# EAGLE design midi2cv.2.2.main (EAGLE 7.2.0)
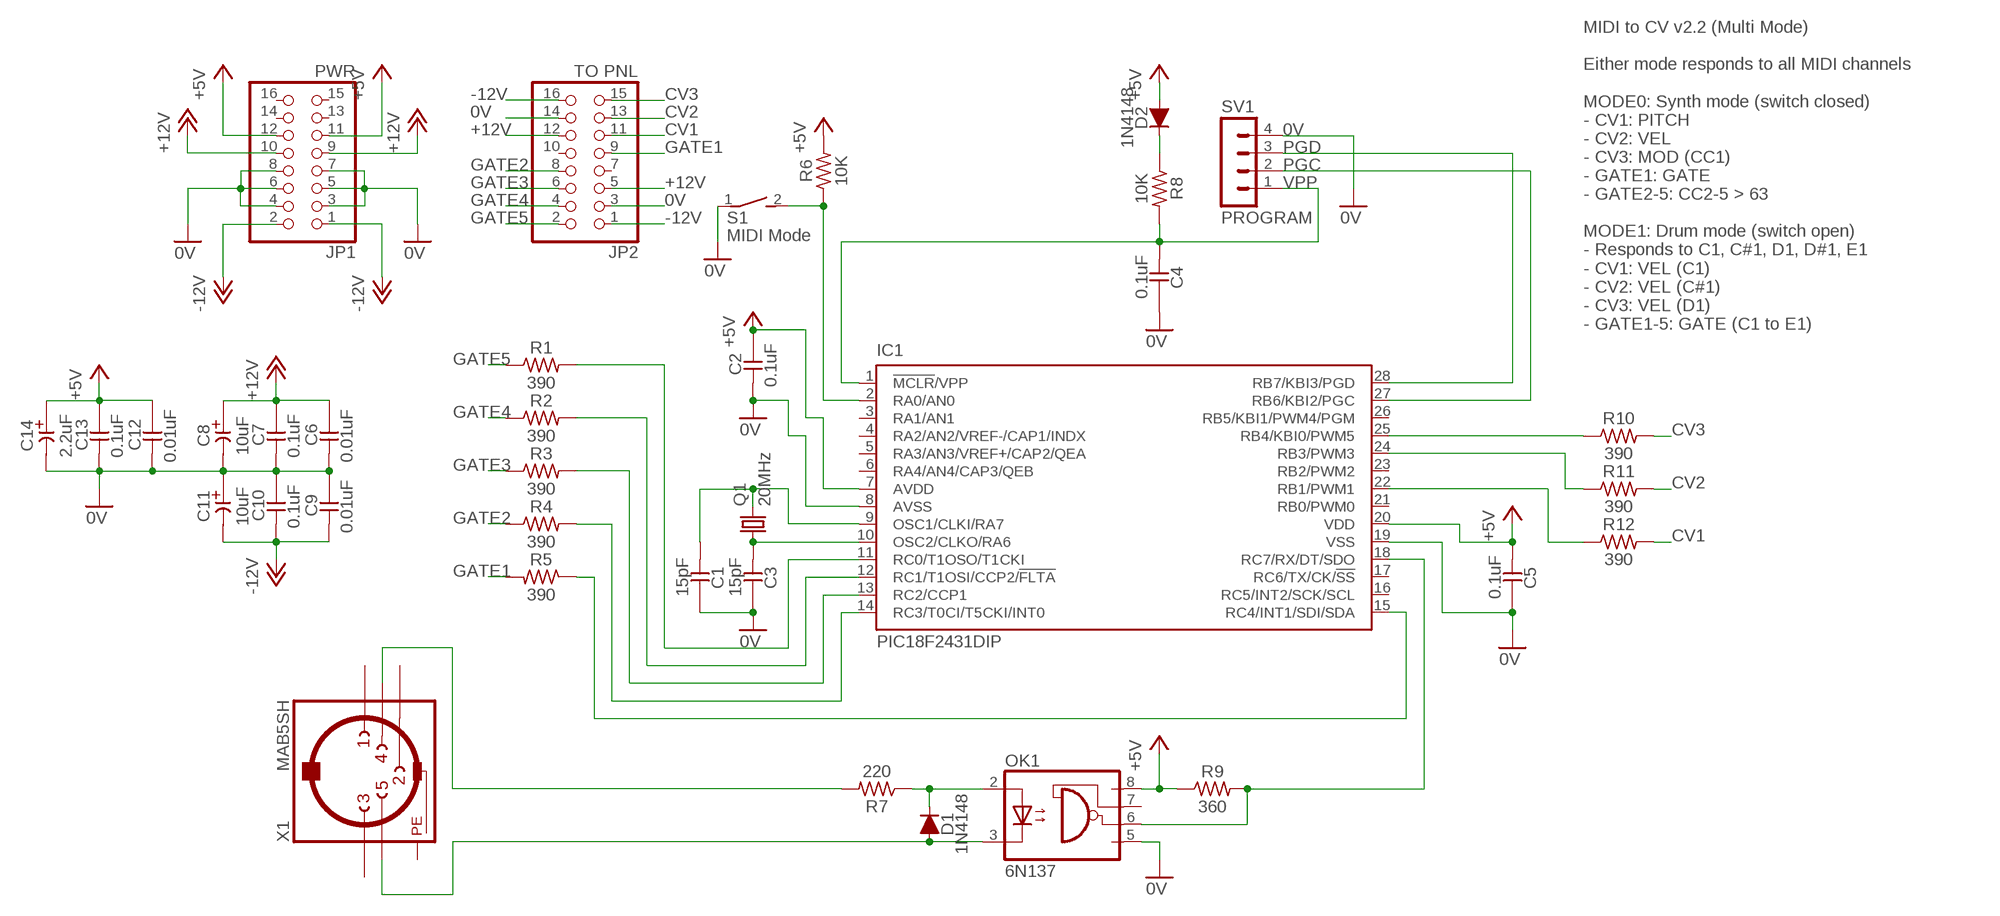
[diagram p0: schematic, sheet 1]

## Parts
C1  15pF  CC-US025-024X044  [C025-024X044]
C2  0.1uF  CC-US025-024X044  [C025-024X044]
C3  15pF  CC-US025-024X044  [C025-024X044]
C4  0.1uF  CC-US025-024X044  [C025-024X044]
C5  0.1uF  CC-US025-024X044  [C025-024X044]
C6  0.01uF  CC-US025-024X044  [C025-024X044]
C7  0.1uF  CC-US025-024X044  [C025-024X044]
C8  10uF  CE-USE2-5  [E2-5]
C9  0.01uF  CC-US025-024X044  [C025-024X044]
C10  0.1uF  CC-US025-024X044  [C025-024X044]
C11  10uF  CE-USE2-5  [E2-5]
C12  0.01uF  CC-US025-024X044  [C025-024X044]
C13  0.1uF  CC-US025-024X044  [C025-024X044]
C14  2.2uF  CE-USE2-5  [E2-5]
D1  1N4148  [DO35-7]
D2  1N4148  [DO35-7]
IC1  PIC18F2431DIP  [DIL28-3]
JP1  PWR  PINHD-2X8  [2X08]
JP2  TO PNL  PINHD-2X8  [2X08]
OK1  6N137  [DIL08]
Q1  20MHz  CRYSTALHC49S  [HC49/S]
R1  390  R0309/10  [0309/10]
R2  390  R0309/10  [0309/10]
R3  390  R0309/10  [0309/10]
R4  390  R0309/10  [0309/10]
R5  390  R0309/10  [0309/10]
R6  10K  R0309/10  [0309/10]
R7  220  R0309/10  [0309/10]
R8  10K  R0309/10  [0309/10]
R9  360  R0309/10  [0309/10]
R10  390  R0309/10  [0309/10]
R11  390  R0309/10  [0309/10]
R12  390  R0309/10  [0309/10]
S1  MIDI Mode  DS01E  [DS-01]
SV1  PROGRAM  MA04-1  [MA04-1]
X1  MAB5SH  [MAB5SH]

## Nets
0V: C1.1 C2.2 C3.1 C4.1 C5.1 C6.2 C7.2 C8.- C9.1 C10.1 C11.+ C12.2 C13.2 C14.- IC1.8(AVSS) IC1.19(VSS) JP1.3 JP1.4 JP1.5 JP1.6 JP1.7 JP1.8 JP2.3 JP2.14 OK1.5(GND) S1.1 SV1.4
+5V: C2.1 C5.2 C12.1 C13.1 C14.+ D2.A IC1.7(AVDD) IC1.20(VDD) JP1.11 JP1.12 OK1.8(VCC) R6.2 R9.1
+12V: C6.1 C7.1 C8.+ JP1.9 JP1.10 JP2.5 JP2.12
-12V: C9.2 C10.2 C11.- JP1.1 JP1.2 JP2.1 JP2.16
CV1: JP2.11 R12.2
CV2: JP2.13 R11.2
CV3: JP2.15 R10.2
GATE1: JP2.9 R5.2
GATE2: JP2.8 R4.1
GATE3: JP2.6 R3.1
GATE4: JP2.4 R2.1
GATE5: JP2.2 R1.1
N$1: D2.C R8.1
N$6: C3.2 IC1.10(OSC2/CLKO/RA6) Q1.1
N$9: R7.2 X1.4
N$10: D1.A OK1.3(C) X1.5
N$11: D1.C OK1.2(A) R7.1
N$13: IC1.18(RC7/RX/DT/SDO) OK1.6(VO) R9.2
N$16: IC1.25(RB4/KBI0/PWM5) R10.1
N$17: IC1.24(RB3/PWM3) R11.1
N$18: IC1.22(RB1/PWM1) R12.1
N$19: IC1.15(RC4/INT1/SDI/SDA) R5.1
N$20: IC1.2(RA0/AN0) R6.1 S1.2
N$26: IC1.11(RC0/T1OSO/T1CKI) R1.2
N$27: C1.2 IC1.9(OSC1/CLKI/RA7) Q1.2
N$28: IC1.12(RC1/T1OSI/CCP2/!FLTA) R2.2
N$29: IC1.13(RC2/CCP1) R3.2
N$30: IC1.14(RC3/T0CI/T5CKI/INT0) R4.2
PGC: IC1.27(RB6/KBI2/PGC) SV1.2
PGD: IC1.28(RB7/KBI3/PGD) SV1.3
VPP: C4.2 IC1.1(!MCLR!/VPP) R8.2 SV1.1
Unconnected: IC1.3(RA1/AN1) IC1.4(RA2/AN2/VREF-/CAP1/INDX) IC1.5(RA3/AN3/VREF+/CAP2/QEA) IC1.6(RA4/AN4/CAP3/QEB) IC1.16(RC5/INT2/SCK/SCL) IC1.17(RC6/TX/CK/!SS) IC1.21(RB0/PWM0) IC1.23(RB2/PWM2) IC1.26(RB5/KBI1/PWM4/PGM) JP1.13 JP1.14 JP1.15 JP1.16 JP2.7 JP2.10 OK1.7(VE) X1.1 X1.2 X1.3

## Notes on the sheet
- MIDI to CV v2.2 (Multi Mode)
  
  Either mode responds to all MIDI channels
  
  MODE0: Synth mode (switch closed)
  - CV1: PITCH
  - CV2: VEL
  - CV3: MOD (CC1)
  - GATE1: GATE
  - GATE2-5: CC2-5 > 63
  
  MODE1: Drum mode (switch open)
  - Responds to C1, C#1, D1, D#1, E1
  - CV1: VEL (C1)
  - CV2: VEL (C#1)
  - CV3: VEL (D1)
  - GATE1-5: GATE (C1 to E1)

## Power pins joined to a net without a drawn wire
PE: X1.PE X1.PE@(PE)

## Library data of the parts
C1-C7 C9 C10 C12 C13 = _common:CC-US: CAPACITOR, US symbol
C8 C11 C14 = _common:CE-US: ELECTROLYTIC CAPACITOR, US symbol
D1 D2 = _common:1N4148: DIODE high speed (Philips)
IC1 = _common:PIC18F2*31: USB Microcontrollers with nanoWatt Technology High-Performance, Enhanced Flash, 28-Pin, Source: http://ww1.microchip.com/downloads/en/devicedoc/39616d.pdf; MF: MICROCHIP; MPN: PIC18F2431-I/SP
JP1 JP2 = pinhead:PINHD-2X8: PIN HEADER
OK1 = optocoupler:6N137: MOTOROLA OPTO COUPLER; MPN: 6N137; OC_FARNELL: 1328376; OC_NEWARK: 52M1895
Q1 = crystal:CRYSTAL: CRYSTAL; OC_FARNELL: 1667008; OC_NEWARK: unknown
R1-R12 = _common:R: RESISTOR, US symbol
S1 = switch-dil:DS01E: DIL/CODE SWITCH; OC_FARNELL: unknown; OC_NEWARK: unknown
SV1 = con-lstb:MA04-1: PIN HEADER; OC_FARNELL: unknown; OC_NEWARK: unknown
X1 = con-hirschmann:MAB5SH: Female CONNECTOR 5 pins 90 deg. with shield, horizontal (DIN 41524); OC_FARNELL: 809883; OC_NEWARK: unknown

## Board
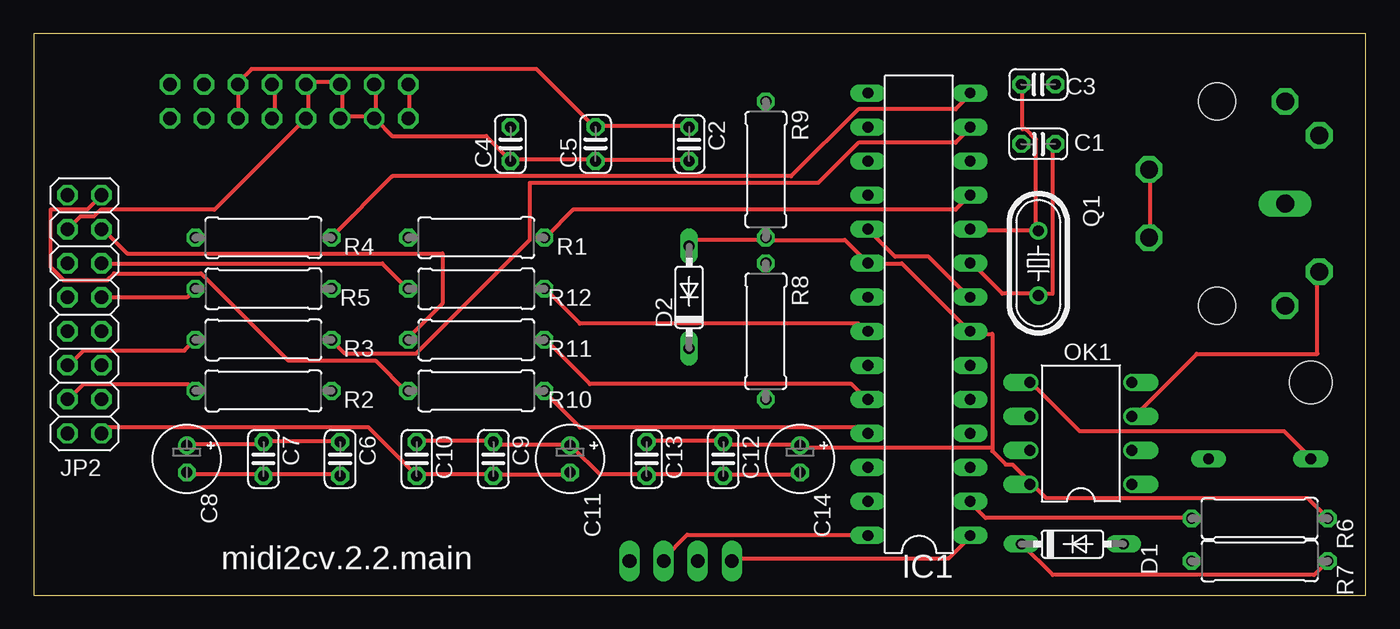
[diagram p1: board, top side]
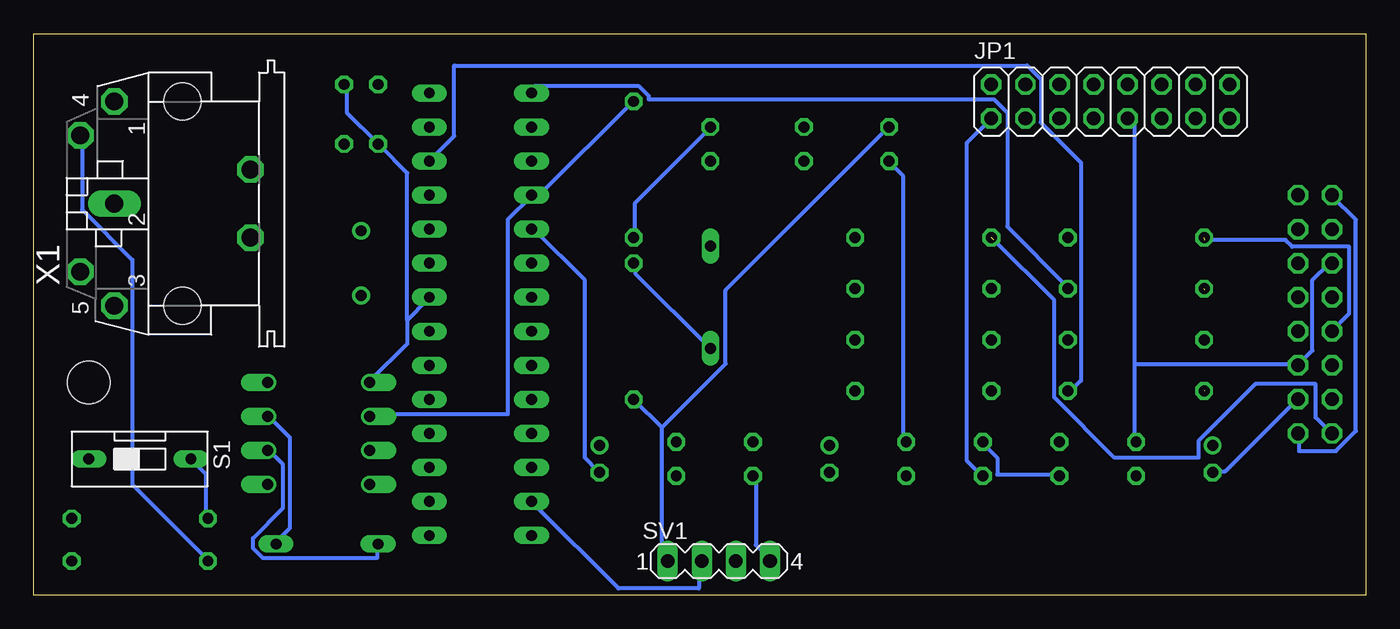
[diagram p2: board, bottom side, seen from below]

Size 99.36 x 41.9 mm. Coordinates in mm from the lower left corner, seen from the top.
Outline: 0,0 99.36,0 99.36,41.9 0,41.9 0,0
Copper layers (1*16): Top 0.035mm / dielectric 1.5mm / Bottom 0.035mm
Design rules "SeeedStudio_2layer_DRU_no_angle_20140221 *": minimum track width 12mil, minimum drill 12mil, track to track 6mil, track to pad 6mil, pad to pad 6mil, via to via 6mil, smd to smd 0mil, copper to edge 10mil, drill to drill 10mil, minimum pad ring 10mil, minimum via ring 6mil, stop-mask expansion 2mil, vias tented up to drill 100mil, thermal gap 10mil
Holes 3.2 mm at 95.25,15.88

### Footprints (pad centres in the part's own frame; a part is rotated, then mirrored left to right if it is on the bottom)
C025-024X044 = drill 0.813 octagon: 1 -1.27,0; 2 1.27,0
E2-5 = drill 0.813 pad 1.27: + -1.016,0 | drill 0.813 pad 1.27 octagon: - 1.016,0
DO35-7 = drill 0.813 long: A 3.81,0; C -3.81,0
DIL28-3 = drill 0.813 long: 1 -16.51,-3.81; 2 -13.97,-3.81; 3 -11.43,-3.81; 4 -8.89,-3.81; 5 -6.35,-3.81; 6 -3.81,-3.81; 7 -1.27,-3.81; 8 1.27,-3.81; 9 3.81,-3.81; 10 6.35,-3.81; 11 8.89,-3.81; 12 11.43,-3.81; 13 13.97,-3.81; 14 16.51,-3.81; 15 16.51,3.81; 16 13.97,3.81; 17 11.43,3.81; 18 8.89,3.81; 19 6.35,3.81; 20 3.81,3.81; 21 1.27,3.81; 22 -1.27,3.81; 23 -3.81,3.81; 24 -6.35,3.81; 25 -8.89,3.81; 26 -11.43,3.81; 27 -13.97,3.81; 28 -16.51,3.81
2X08 = drill 1.016 octagon: 1 -8.89,-1.27; 2 -8.89,1.27; 3 -6.35,-1.27; 4 -6.35,1.27; 5 -3.81,-1.27; 6 -3.81,1.27; 7 -1.27,-1.27; 8 -1.27,1.27; 9 1.27,-1.27; 10 1.27,1.27; 11 3.81,-1.27; 12 3.81,1.27; 13 6.35,-1.27; 14 6.35,1.27; 15 8.89,-1.27; 16 8.89,1.27
DIL08 = drill 0.813 offset: 1 -3.81,-3.81; 2 -1.27,-3.81; 3 1.27,-3.81; 4 3.81,-3.81; 5 3.81,3.81; 6 1.27,3.81; 7 -1.27,3.81; 8 -3.81,3.81
HC49/S = drill 0.813: 1 -2.413,0; 2 2.413,0
0309/10 = drill 0.813 octagon: 1 -5.08,0; 2 5.08,0
DS-01 = drill 0.813 long: 1 0,-3.81; 2 0,3.81
MA04-1 = drill 1.016 long: 1 -3.81,0; 2 -1.27,0; 3 1.27,0; 4 3.81,0
MAB5SH = drill 1.321 octagon: 1 7.62,5.08; 3 -7.62,5.08; 4 5.08,7.62; 5 -5.08,7.62; PE -2.54,-5.08; PE@ 2.54,-5.08 | drill 1.321 long: 2 0,5.08 | hole 2.794: 7.62,0; -7.62,0

### Placement (x,y rotation side)
C1  74.93,33.66 0 top
C2  48.9,33.66 270 top
C3  74.93,38.1 180 top
C4  35.56,33.66 90 top
C5  41.91,33.66 90 top
C6  22.86,10.16 270 top
C7  17.14,10.16 270 top
C8  11.43,10.16 270 top
C9  34.29,10.16 270 top
C10  28.57,10.16 270 top
C11  40.01,10.16 270 top
C12  51.44,10.16 270 top
C13  45.72,10.16 270 top
C14  57.15,10.16 270 top
D1  77.47,3.81 0 top
D2  48.9,22.23 90 top
IC1  66.04,20.95 90 top
JP1  19.05,36.83 0 bottom
JP2  3.81,20.95 90 top
OK1  78.11,12.06 90 top
Q1  74.93,24.77 270 top
R1  33.02,26.67 0 top
R2  17.14,15.24 0 top
R3  17.14,19.05 0 top
R4  17.14,26.67 0 top
R5  17.14,22.86 180 top
R6  91.44,5.71 0 top
R7  91.44,2.54 180 top
R8  54.61,19.68 270 top
R9  54.61,31.75 90 top
R10  33.02,15.24 180 top
R11  33.02,19.05 180 top
R12  33.02,22.86 180 top
S1  91.44,10.16 270 bottom
SV1  48.26,2.54 0 bottom
X1  88.27,29.21 90 bottom

### Tracks (layer width: path | path; a pad name or v marks a point on that pad's centre or on a via)
0V
  Top 0.305: S1.1 95.25,10.25 93.25,12.25 78,12.25 74.5,15.75 OK1.5 | IC1.19 62.25,27.25 64.25,25.25 66.75,25.25 69.75,22.25 IC1.8 | C2.2 48.75,32.5 42,32.5 C5.1 41.75,32.5 35.75,32.5 C4.1 35.5,32.5 33.75,34.25 26.75,34.25 25.5,35.5 JP1.3 | JP1.3 25.5,35.75 25.5,38 JP1.4 | 23,35.75 23,38 JP1.6 22.75,38.25 20.5,38.25 JP1.8 20.5,38 20.5,35.75 JP1.7 20.25,35.5 13.5,28.75 5,28.75 4.5,28.25 3.5,28.25 2.75,27.5 JP2.14 | 23,35.75 25.25,35.75 JP1.3 | 23,35.75 JP1.5 | C6.2 22.75,9 17.25,9 C7.2 17,9 11.5,9 C8.- | C10.1 28.75,11.5 34.25,11.5 C9.1 34.5,11.25 40,11.25 C11.+ 40.25,11 42.25,9 45.5,9 C13.2 45.75,9 51.25,9 C12.2 51.5,9 57,9 C14.-
  Bottom 0.305: C3.1 76,38 76,36 73.75,33.75 C1.1 73.5,33.5 71.5,31.5 71.5,20.5 | 71.5,20.5 71.5,18.75 74.25,16 OK1.5 | 71.5,20.5 70,22 IC1.8 | JP2.3 5.25,14.5 10.5,9.25 11.25,9.25 C8.- | SV1.4 44.5,2.75 45.5,3.75 45.5,8.75 C13.2 | C6.2 23,9 27.5,9 27.5,10.25 28.5,11.25 C10.1 | C4.1 35.5,32.25 34.5,31.25 34.5,11.5 C9.1 | IC1.19 62,27.25 58.25,23.5 58.25,10.25 57.25,9.25 C14.-
+5V
  Top 0.305: JP1.11 15.25,35.75 15.25,38 JP1.12 15.25,38.25 16.25,39.25 37.5,39.25 41.75,35 C5.2 42,35 48.75,35 C2.1 | C13.1 45.75,11.5 51.25,11.5 C12.1 51.5,11.25 57,11.25 C14.+ 57.25,11 71.5,11 | D2.A 49,26.25 49.25,26.5 54.5,26.5 R9.1 54.75,26.5 60.5,26.5 62,25 IC1.20 62.25,24.75 64.75,24.75 69.75,19.75 IC1.7 70,19.5 71.5,19.5 71.5,11 | 71.5,11 71.5,10.75 72.5,9.75 73,9.75 74.25,8.5 OK1.8 74.5,8.25 75.5,7.25 95,7.25 96.5,5.75 R6.2
  Bottom 0.305: C2.1 49,34.75 54.5,29.25 54.5,26.75 R9.1
+12V
  Top 0.305: JP1.9 18,35.75 18,38 JP1.10 | C8.+ 11.5,11.25 17,11.25 C7.1 17.25,11.5 22.75,11.5 C6.1
  Bottom 0.305: JP2.12 2.75,24.75 4,23.5 4,18.25 5,17.25 JP2.5 5.25,17.25 17.25,17.25 | 17.25,17.25 17.25,11.5 C7.1 | 17.25,17.25 17.25,35 17.75,35.5 JP1.9
-12V
  Top 0.305: JP1.1 28,35.75 28,38 JP1.2 | C11.- 40,9 34.5,9 C9.2 34.25,9 28.75,9 C10.2 28.5,9 25,12.5 5.5,12.5 5.25,12.25 JP2.1
  Bottom 0.305: JP2.16 2.5,29.75 0.75,28 0.75,12.25 2.25,10.75 5,10.75 5,12 JP2.1 | JP1.1 29.75,33.75 29.75,10 28.75,9 C10.2
CV1
  Top 0.305: R12.2 27.75,23 26,24.75 5.25,24.75 JP2.11
CV2
  Top 0.305: R11.2 28,19.25 30.5,21.75 30.5,25.5 7,25.5 5.25,27.25 JP2.13
CV3
  Top 0.305: R10.2 27.75,15.25 25.5,17.5 19,17.5 12.5,24 6,24 5.5,23.5 2.25,23.5 1.25,24.5 1.25,28.75 4,28.75 5,29.75 JP2.15
GATE1  (1 unrouted)
  Top 0.305: 12,22.75 11.5,22.25 5.25,22.25 JP2.9
GATE2  (1 unrouted)
  Bottom 0.305: 12,26.5 6,26.5 5.5,26 1.25,26 1.25,21 2.5,19.75 JP2.8
GATE3
  Top 0.305: R3.1 12,19 11.25,18.25 3.75,18.25 2.75,17.25 JP2.6
GATE4  (1 unrouted)
  Top 0.305: 12,15.25 11.5,15.75 3.75,15.75 2.75,14.75 JP2.4
GATE5  (1 unrouted)
  Bottom 0.305: 27.75,26.5 23.25,22 23.25,14.75 18.75,10.25 12.5,10.25 12.5,11.5 8.25,15.75 3.75,15.75 3.75,13.25 2.75,12.25 JP2.2
N$1
  Bottom 0.305: D2.C 49,18.5 54.5,24 54.5,24.75 R8.1
N$6
  Top 0.305: 74.75,27.25 70,27.25 IC1.10 | 74.75,27.25 74.75,34 74,34.75 73.75,34.75 73.75,38 C3.2 | 74.75,27.25 Q1.1
N$9
  Bottom 0.305: R7.2 86.5,2.75 92,8.25 92,25 95.75,28.75 95.75,34.25 X1.4
N$10
  Top 0.305: X1.5 95.75,24 95.75,18 86.75,18 82.25,13.5 82,13.5 OK1.3
  Bottom 0.305: D1.A 81.25,4 80.25,5 80.25,11.75 81.75,13.25 OK1.3
N$11
  Top 0.305: D1.C 73.75,3.75 76,1.5 95.5,1.5 96.5,2.5 R7.1
  Bottom 0.305: OK1.2 81.75,10.75 80.75,9.75 80.75,6.5 83,4.25 83,3.5 82.25,2.75 73.75,2.75 73.75,3.75 D1.C
N$13
  Bottom 0.305: OK1.6 74.25,13.5 64,13.5 64,28 62.25,29.75 IC1.18 62,30 61.5,30 54.75,36.75 R9.2
N$16
  Top 0.305: R10.1 38.25,15 40.75,12.5 61.75,12.5 62,12.25 IC1.25
N$17
  Top 0.305: R11.1 38.25,19 41.5,15.75 61,15.75 62,14.75 IC1.24
N$18
  Top 0.305: R12.1 38.25,22.75 40.75,20.25 61.5,20.25 62,19.75 IC1.22
N$19
  Bottom 0.305: R5.1 22.25,23 26.75,27.5 26.75,36 27.75,37 53.5,37 53.5,37.25 54.25,38 62,38 62,37.5 IC1.15
N$20
  Top 0.305: IC1.2 70,6.75 71,5.75 86.25,5.75 R6.1
  Bottom 0.305: S1.2 87.5,10 86.5,9 86.5,5.75 R6.1
N$26
  Top 0.305: R1.2 38.25,26.75 40.25,28.75 68.75,28.75 69.75,29.75 IC1.11
N$27
  Top 0.305: IC1.9 70,24.75 72.25,22.5 74.75,22.5 Q1.2 75,22.5 76,22.5 76,33.5 C1.2
N$28
  Bottom 0.305: R2.2 22,15.25 21.25,16 21.25,32.25 24.25,35.25 24.25,38.5 25.25,39.5 68,39.5 68,34.25 69.75,32.5 IC1.12
N$29
  Top 0.305: R3.2 22.25,19 23.25,18 28.5,18 37,26.5 37,30.75 58.5,30.75 61.5,33.75 68.75,33.75 69.75,34.75 IC1.13
N$30
  Top 0.305: R4.2 22.25,26.75 26.75,31.25 56.5,31.25 61.5,36.25 68.75,36.25 69.75,37.25 IC1.14
PE
  Top 0.305: X1.PE 83.25,26.75 83.25,31.75 X1.PE@
PGC
  Bottom 0.305: IC1.27 62,6.75 55.75,0.5 49.75,0.5 49.75,2.5 SV1.2
PGD
  Top 0.305: IC1.28 62,4.5 48.75,4.5 47,2.75 SV1.3
VPP
  Top 0.305: IC1.1 69.75,4.25 68.25,2.75 52.25,2.75 SV1.1
  Bottom 0.305: 52.5,12.5 54.5,14.5 R8.2 | 52.5,12.5 52.5,3 52.25,2.75 SV1.1 | 52.5,12.5 47.75,17.25 47.75,22.75 35.75,34.75 C4.2

### Text on the board
tNames: midi2cv.2.2.main